# Altium project Thermo_board.PrjPcb
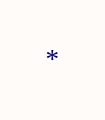
[diagram p0: Schematic.SchDoc]
Rev: A.0; Engineer: Domenico Spagnuolo
1 sheet, 1 parts. Net scope: global (net labels, ports and power ports of the same name join across sheets).
Board file: PCB.PcbDoc

## Sheet Schematic.SchDoc: Thermo Board
size A3; Engineer: Domenico Spagnuolo; DocumentNumber: 1; SheetNumber: 1; SheetTotal: 1

### Parts
*  Title Block  (value not drawn)